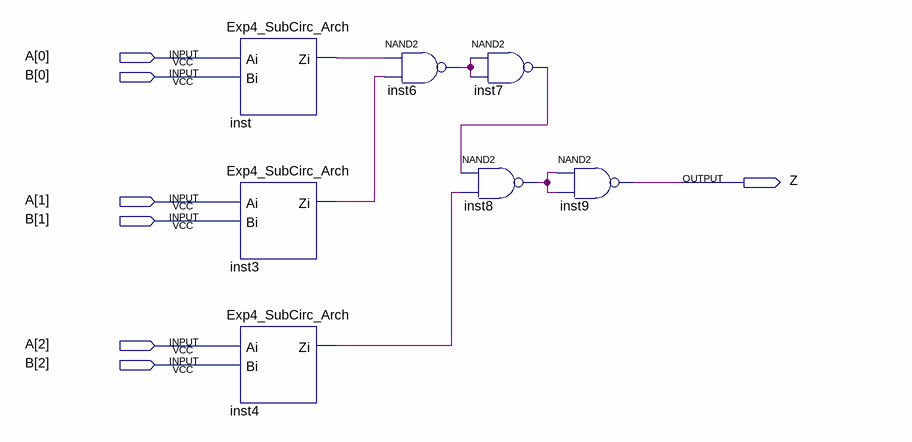
[diagram p0: schematic sheet]
// Quartus schematic Exp41.bdf as structural Verilog: 7 symbols, 7 pins
module Exp41 (
  input  [2:0] A,
  input  [2:0] B,
  output Z
);

  wire inst3_zi, inst4_zi, inst6_out, inst7_out, inst8_out, inst_zi;

  Exp4_SubCirc_Arch inst (.Ai(A[0]), .Bi(B[0]), .Zi(inst_zi));
  Exp4_SubCirc_Arch inst3 (.Ai(A[1]), .Bi(B[1]), .Zi(inst3_zi));
  Exp4_SubCirc_Arch inst4 (.Ai(A[2]), .Bi(B[2]), .Zi(inst4_zi));
  nand inst6 (inst6_out, inst_zi, inst3_zi);
  nand inst7 (inst7_out, inst6_out, inst6_out);
  nand inst8 (inst8_out, inst7_out, inst4_zi);
  nand inst9 (Z, inst8_out, inst8_out);
endmodule
